# EAGLE design M5stamp_round_lcd (EAGLE 7.7.0)
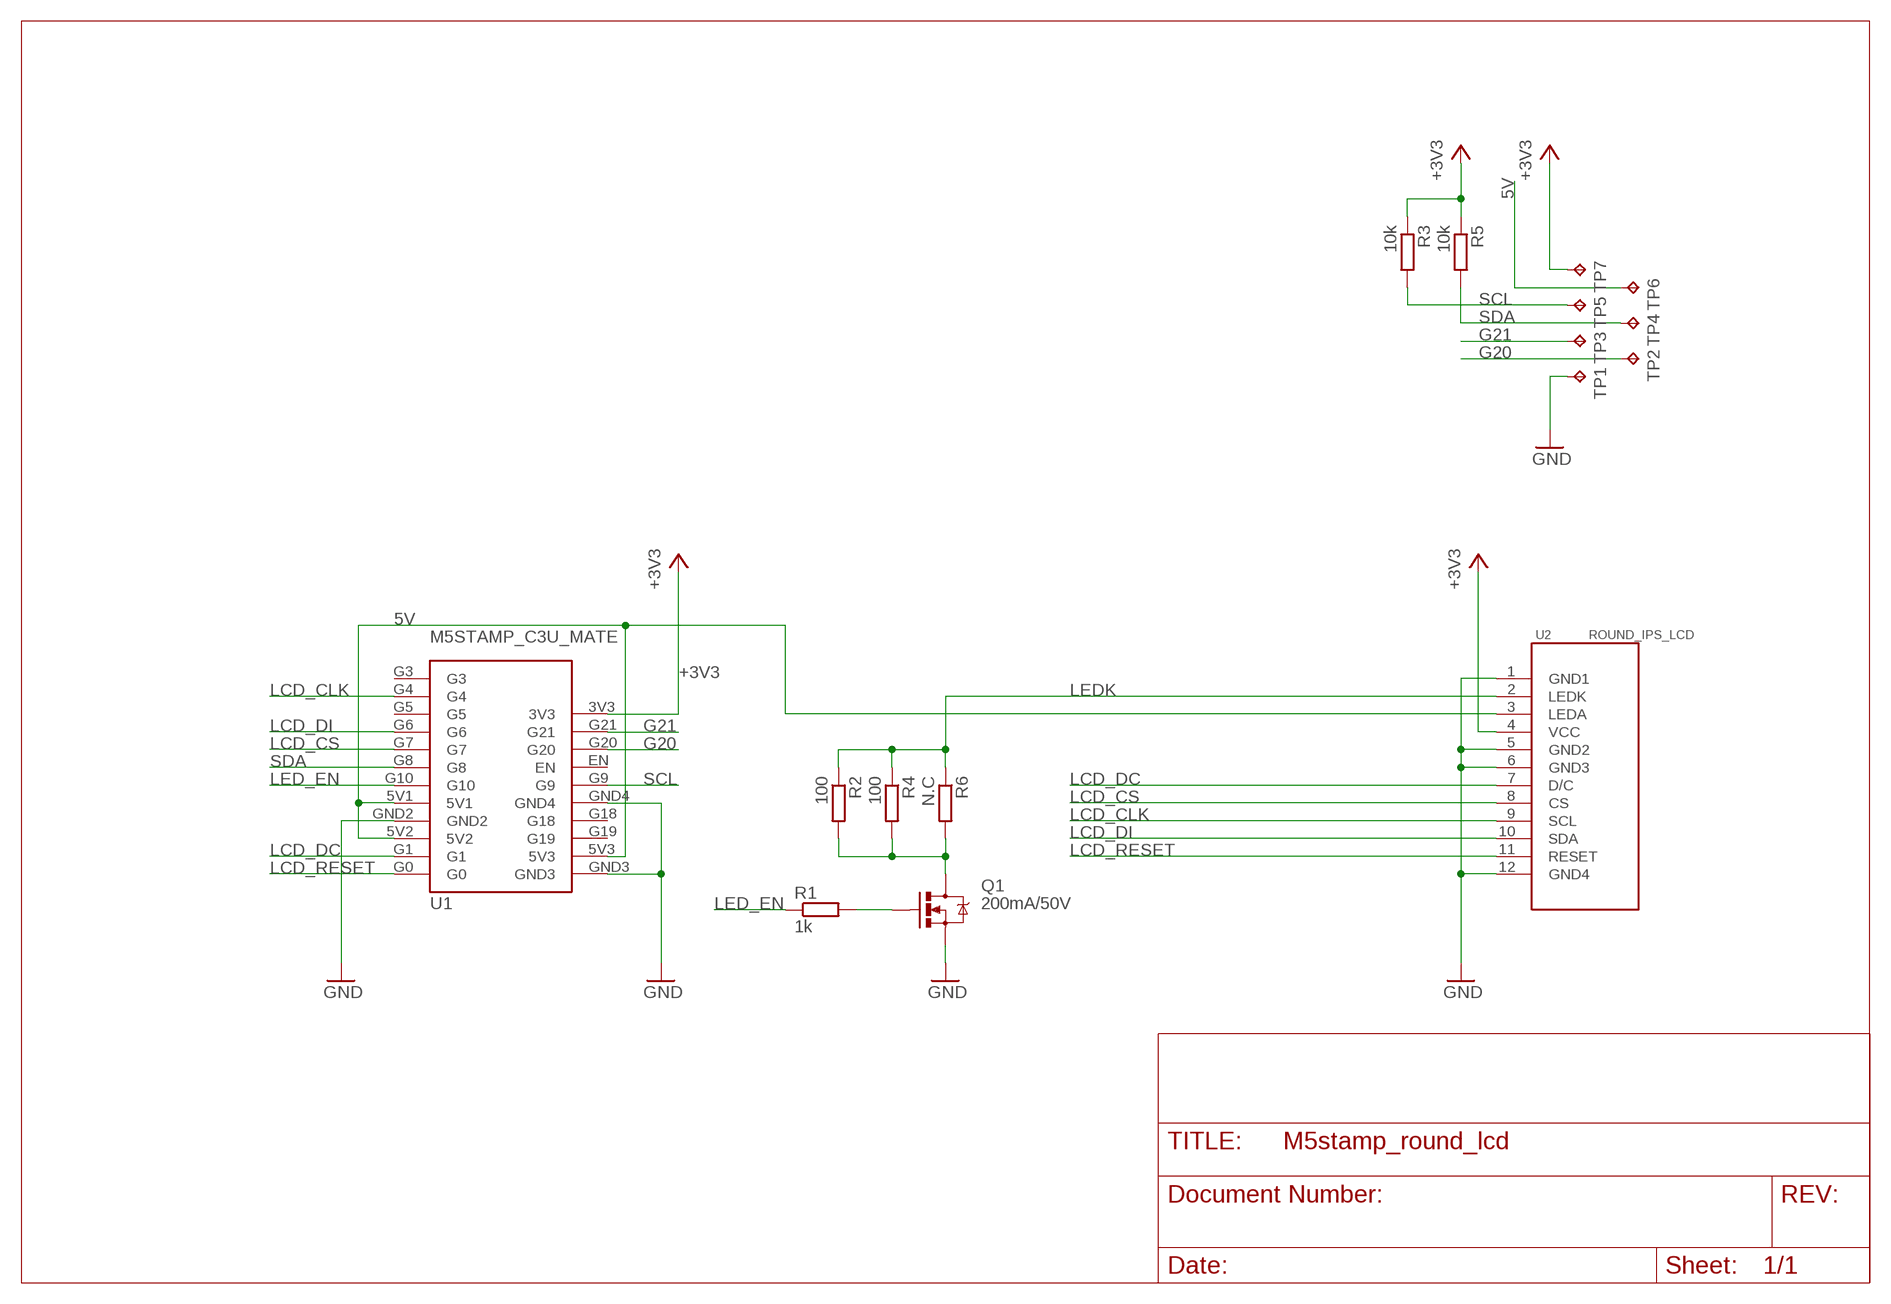
[diagram p0: schematic, sheet 1]

## Parts
Q1  200mA/50V  MOSFET-NCHANNELBSS138  [SOT23-3]
R1  1k  R-EU_R0603  [R0603]
R2  100  R-EU_R0603  [R0603]
R3  10k  R-EU_R0603  [R0603]
R4  100  R-EU_R0603  [R0603]
R5  10k  R-EU_R0603  [R0603]
R6  N.C  R-EU_R0603  [R0603]
TP1  TPTP18R  [TP18R]
TP2  TPTP18R  [TP18R]
TP3  TPTP18R  [TP18R]
TP4  TPTP18R  [TP18R]
TP5  TPTP18R  [TP18R]
TP6  TPTP18R  [TP18R]
TP7  TPTP18R  [TP18R]
U1  M5STAMP_C3U_MATE  [M5STAMPC3UMATE]
U2  ROUND_IPS_LCD  [ROUND_IPS_LCD]

## Nets
5V [usbvcc]: TP6.TP U1.5V1 U1.5V2 U1.5V3 U2.3(LEDA)
+3V3 [pow]: R3.1 R5.1 TP7.TP U1.3V3 U2.4(VCC)
G20: TP2.TP U1.G20
G21: TP3.TP U1.G21
GND: Q1.2(S) TP1.TP U1.GND2 U1.GND3 U1.GND4 U2.1(GND1) U2.5(GND2) U2.6(GND3) U2.12(GND4)
LCD_CLK: U1.G4 U2.9(SCL)
LCD_CS: U1.G7 U2.8(CS)
LCD_DC: U1.G1 U2.7(D/C)
LCD_DI: U1.G6 U2.10(SDA)
LCD_RESET: U1.G0 U2.11(RESET)
LED_EN: R1.1 U1.G10
LEDK [usbvcc]: R2.1 R4.1 R6.1 U2.2(LEDK)
N$1 [GND]: Q1.3(D) R2.2 R4.2 R6.2
N$2: Q1.1(G) R1.2
SCL: R3.2 TP5.TP U1.G9
SDA: R5.2 TP4.TP U1.G8
Unconnected: U1.EN U1.G3 U1.G5 U1.G18 U1.G19

## Library data of the parts
Q1 = suna_lib:MOSFET-NCHANNEL: Common NMOSFET Parts MFG P/N Store ID Prod ID FDD8780 TRANS-09984 SI7820DN TRANS-11055 FDS6630A IC-08089 2N7002PW TRANS-11151 FQP30N06L COM-10213 TRANS-10060 BSS123LT1G TRANS-08345 BSS138 TRANS-00830 BS170 2N7000; PROD_ID: TRANS-00830
R1-R6 = resistor:R-EU_: RESISTOR, European symbol
TP1-TP7 = testpad:TP: Test pad
U1 = suna_lib:M5STAMP_C3U_MATE
U2 = suna_lib:ROUND_IPS_LCD

## Net classes
1 pow: width 0.508 mm
2 GND: width 0.61 mm
3 usbvcc: width 0.508 mm, clearance 0.254 mm
4 aref: width 0.406 mm, clearance 0.254 mm

## Board
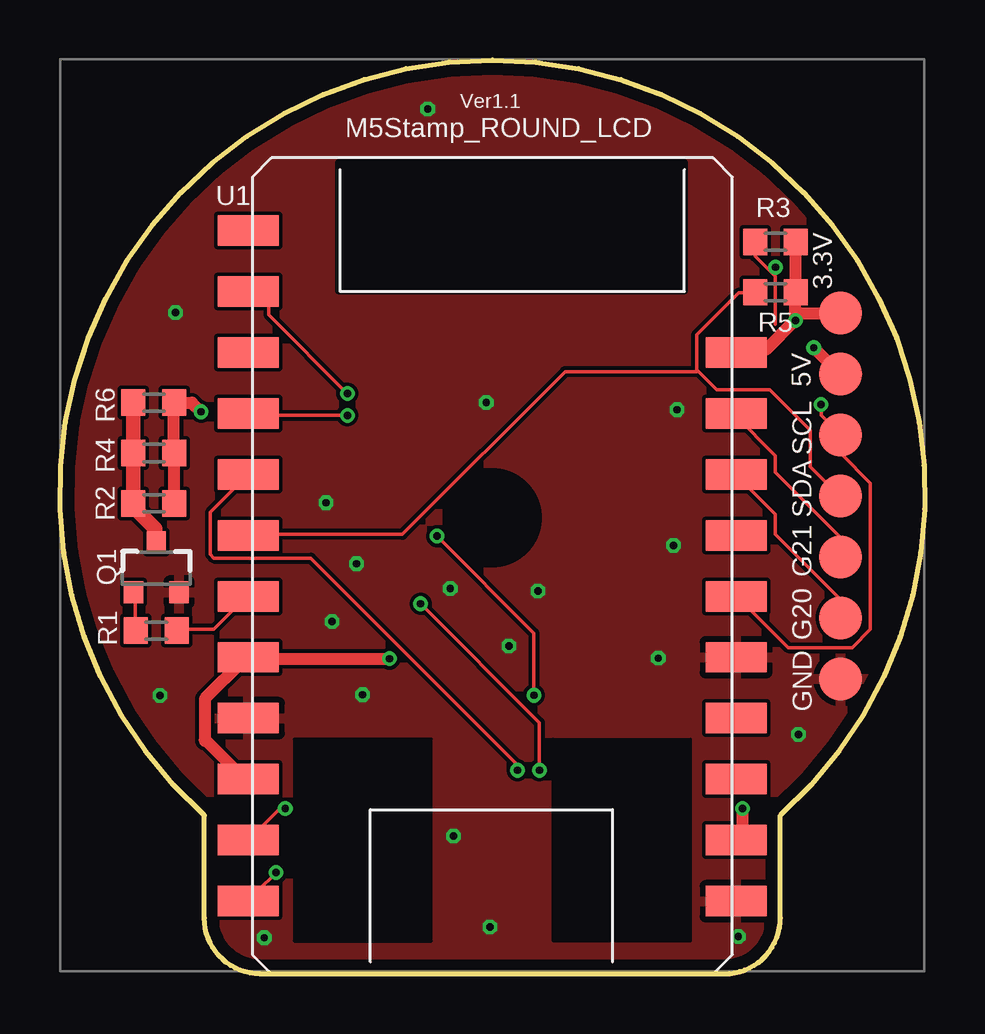
[diagram p1: board, top side]
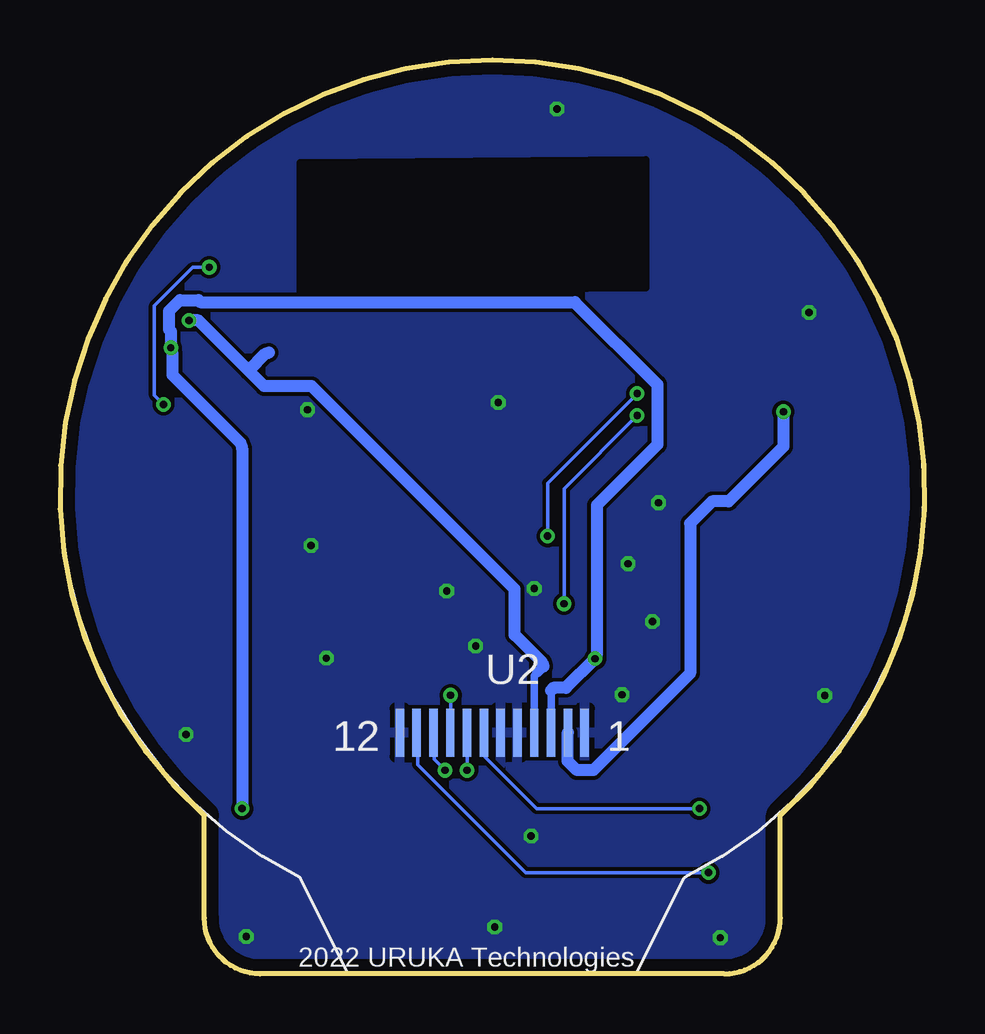
[diagram p2: board, bottom side, seen from below]

Size 36.02 x 38.08 mm. Coordinates in mm from the lower left corner, seen from the top.
Outline: 8.34,0 27.69,0 arc90 30.01,2.33 30.01,6.6 arc277 6.01,6.6 6.01,2.33 arc90 8.34,0
Copper layers (1*16): Top 0.035mm / dielectric 1.53mm / Bottom 0.035mm
Design rules "seeed_pban_5mil": minimum track width 6mil, minimum drill 12mil, track to track 6mil, track to pad 0.229mm, pad to pad 6mil, via to via 6mil, smd to smd 5mil, copper to edge 0.5mm, drill to drill 0.5mm, minimum pad ring 10mil, minimum via ring 6mil, stop-mask expansion 4mil, vias tented up to drill 25mil, thermal gap 10mil
tRestrict: area 11.6,28.5 to 26,33.8
bRestrict: area 11.6,28.5 to 26,33.9

### Footprints (pad centres in the part's own frame; a part is rotated, then mirrored left to right if it is on the bottom)
SOT23-3 = smd 0.8 x 0.9: 1 -0.95,-1; 2 0.95,-1; 3 0,1.1
R0603 = smd 1 x 1.1: 1 -0.85,0; 2 0.85,0
TP18R = smd 1.8 x 1.8: TP 0,0
M5STAMPC3UMATE = smd 2.54 x 1.27: 3V3 10.16,8.89; 5V1 -10.16,-3.81; 5V2 -10.16,-8.89; 5V3 10.16,-11.43; EN 10.16,1.27; G0 -10.16,-13.97; G1 -10.16,-11.43; G3 -10.16,13.97; G4 -10.16,11.43; G5 -10.16,8.89; G6 -10.16,6.35; G7 -10.16,3.81; G8 -10.16,1.27; G9 10.16,-1.27; G10 -10.16,-1.27; G18 10.16,-6.35; G19 10.16,-8.89; G20 10.16,3.81; G21 10.16,6.35; GND2 -10.16,-6.35; GND3 10.16,-13.97; GND4 10.16,-3.81
ROUND_IPS_LCD = smd 0.35 x 2: 1 3.85,-9.95; 2 3.15,-9.95; 3 2.45,-9.95; 4 1.75,-9.95; 5 1.05,-9.95; 6 0.35,-9.95; 7 -0.35,-9.95; 8 -1.05,-9.95; 9 -1.75,-9.95; 10 -2.45,-9.95; 11 -3.15,-9.95; 12 -3.85,-9.95

### Placement (x,y rotation side)
Q1  4.01,16.9 0 top
R1  4.01,14.3 180 top
R2  3.91,19.6 180 top
R3  29.81,30.5 180 top
R4  3.91,21.7 180 top
R5  29.81,28.4 180 top
R6  3.91,23.8 180 top
TP1  32.52,12.29 0 top
TP2  32.52,14.83 0 top
TP3  32.52,17.37 0 top
TP4  32.52,19.91 0 top
TP5  32.52,22.45 0 top
TP6  32.52,24.99 0 top
TP7  32.52,27.53 0 top
U1  18.01,17 0 top
U2  18.01,20 0 bottom

### Tracks (layer width: path | path; a pad name or v marks a point on that pad's centre or on a via)
5V  (via drill 0.3)
  Top 0.508: 8.7,13.13 7.86,13.13 U1.5V1 | 8.7,13.13 v13.73,13.13 | 6.03,9.78 7.63,8.18 7.78,8.18 U1.5V2 8.09,8.1 8.65,8.1 | 6.03,9.78 6.03,11.45 7.63,13.05 U1.5V1 | 28.13,5.59 U1.5V3 | 6.03,9.7 6.03,9.78 | v28.44,6.88 28.44,5.59 U1.5V3 | 8.7,13.13 U1.5V1 | 8.7,13.13 8.65,13.18 | 27.32,5.56 27.37,5.59 27.9,5.59 U1.5V3 | v31.41,26.08 32.47,25.02 TP6.TP
  Bottom 0.305: 15.56,11.8 15.56,10.08 U2.3
  Bottom 0.508: 15.56,11.8 15.48,11.91 14.95,11.91 v13.73,13.13 13.65,13.36 13.65,19.53 11.14,22.05 11.14,24.56 14.57,27.99 30.19,27.99 30.26,28.07 31.03,28.07 31.48,27.61 31.48,26.85 31.41,26.77 v31.41,26.08 31.33,25.86 31.33,24.94 28.51,22.12 28.44,21.89 v28.44,6.88
+3V3  (via drill 0.3)
  Top 0.508: R3.1 30.64,30.43 30.64,28.45 R5.1 30.64,28.14 30.64,27.53 | 30.64,27.53 v30.64,27.23 29.43,26.01 28.36,26.01 U1.3V3 28.13,25.93 27.44,25.93 27.32,25.88 | 30.64,27.53 TP7.TP
  Bottom 0.305: U2.4 16.26,12.42 16.14,12.55
  Bottom 0.406: 16.14,12.55 15.89,12.8
  Bottom 0.508: v30.64,27.23 30.26,27.23 28.17,25.13 | 28.17,25.13 27.52,24.48 25.54,24.48 17.08,16.03 17.08,14.12 15.94,12.98 15.89,12.8 | 28.17,25.13 27.44,25.86 27.32,25.88
G20
  Top 0.152: TP2.TP 32.47,14.88 32.47,15.64 29.81,18.31 29.81,19.15 28.21,20.75 U1.G20
G21
  Top 0.152: 27.32,23.34 28.13,23.34 U1.G21 28.13,23.27 29.81,21.59 29.81,20.9 32.47,18.24 32.47,17.4 TP3.TP
GND  (via drill 0.3)
  other vias: 17.91,1.95 28.26,1.55 8.51,1.5 4.16,11.6 16.26,16.05 17.76,23.8 15.32,36.03 4.81,27.55 19.91,15.95 16.4,5.74 25.56,17.85 25.71,23.5 11.34,14.67 12.35,17.09 11.08,19.63 18.7,13.66 12.61,11.63 30.77,9.98 24.93,13.15
  pour Bottom: -1.49,-0.7 37.41,-0.7 37.41,38.9 -1.49,38.9
  pour Top: -0.99,-1.2 38.01,-1.2 38.01,39.2 -0.99,39.2
LCD_CLK  (via drill 0.3)
  Top 0.152: U1.G4 7.86,28.45 8.62,28.45 8.7,28.37 8.7,27.46 v11.98,24.18 | v19.75,11.61 19.75,14.2 v15.71,18.24
  Bottom 0.152: v19.75,11.61 19.75,10.08 U2.9 | v15.71,18.24 15.71,20.45 v11.98,24.18
LCD_CS  (via drill 0.3)
  Top 0.152: 8.65,20.8 8.62,20.83 7.86,20.83 U1.G7 7.78,20.75 6.26,19.23 6.26,17.47 6.41,17.32 10.45,17.32 19.06,8.71 v19.06,8.48
  Bottom 0.152: v19.06,8.48 U2.8
LCD_DC  (via drill 0.3)
  Top 0.152: v9.39,6.88 9.16,6.88 8.24,5.97 | 8.24,5.97 7.86,5.59 U1.G1 8.24,5.97 | 8.24,5.97 8.65,5.56
  Bottom 0.152: v9.39,6.88 16.17,6.88 18.3,9.01 18.3,10.01 U2.7
LCD_DI  (via drill 0.3)
  Top 0.152: U1.G6 8.7,23.34 8.78,23.27 v11.98,23.27 | v19.98,8.48 19.98,10.46 v15.02,15.42
  Bottom 0.152: v19.98,8.48 20.43,8.94 20.43,10.01 U2.10 | v15.02,15.42 15.02,20.22 v11.98,23.27
LCD_RESET  (via drill 0.3)
  Top 0.152: 8.24,3.45 7.86,3.07 U1.G0 8.24,3.45 | 8.24,3.45 v9,4.21 | 8.24,3.45 8.62,3.07 8.65,3.02
  Bottom 0.152: v9,4.21 16.62,4.21 21.12,8.71 21.12,10.01 U2.11
LED_EN
  Top 0.152: R1.1 4.89,14.35 6.41,14.35 7.78,15.72 U1.G10 8.65,15.72
LEDK  (via drill 0.3)
  Top 0.508: R2.1 4.74,19.61 4.74,21.67 R4.1 4.74,21.89 4.74,23.8 R6.1 4.97,23.8 5.5,23.8 v5.88,23.42
  Bottom 0.508: U2.2 14.87,10.01 14.87,8.86 14.49,8.48 13.8,8.48 9.77,12.52 9.77,18.77 8.85,19.68 8.17,19.68 5.88,21.97 v5.88,23.42
N$1
  Top 0.61: Q1.3 3.97,18.01 3.97,18.54 3.14,19.38 3.14,19.53 R2.2 3.06,19.84 3.06,21.67 R4.2 3.06,21.97 R6.2
N$2
  Top 0.152: Q1.1 3.14,15.87 3.14,14.35 R1.2
SCL  (via drill 0.3)
  Top 0.152: 29.62,29.25 29.81,29.06 29.81,27.08 | 29.62,29.25 28.97,29.89 28.97,30.43 R3.2 | U1.G9 28.21,15.72 30.34,13.59 33.01,13.59 33.77,14.35 33.77,20.45 32.55,21.67 32.55,22.43 TP5.TP 31.71,23.27 v31.71,23.72 | v29.81,29.44 29.62,29.25
  Bottom 0.152: v29.81,29.44 30.49,29.44 32.09,27.84 32.09,24.1 v31.71,23.72
SDA
  Top 0.152: 26.57,25.13 27.37,24.33 29.58,24.33 31.25,22.66 31.25,21.13 32.47,19.91 TP4.TP | 26.57,25.13 26.53,25.17 26.53,26.62 28.28,28.37 28.89,28.37 R5.2 | U1.G8 7.86,18.31 14.26,18.31 21.04,25.09 26.53,25.09 26.57,25.13

### Text on the board
tPlace: Ver1.1 | M5Stamp_ROUND_LCD | 3.3V | 5V | SCL | SDA | G21 | G20 | GND
bPlace: 2022 URUKA Technologies